# EAGLE design WMC (EAGLE 9.5.1)

## Sheet 1 of 2
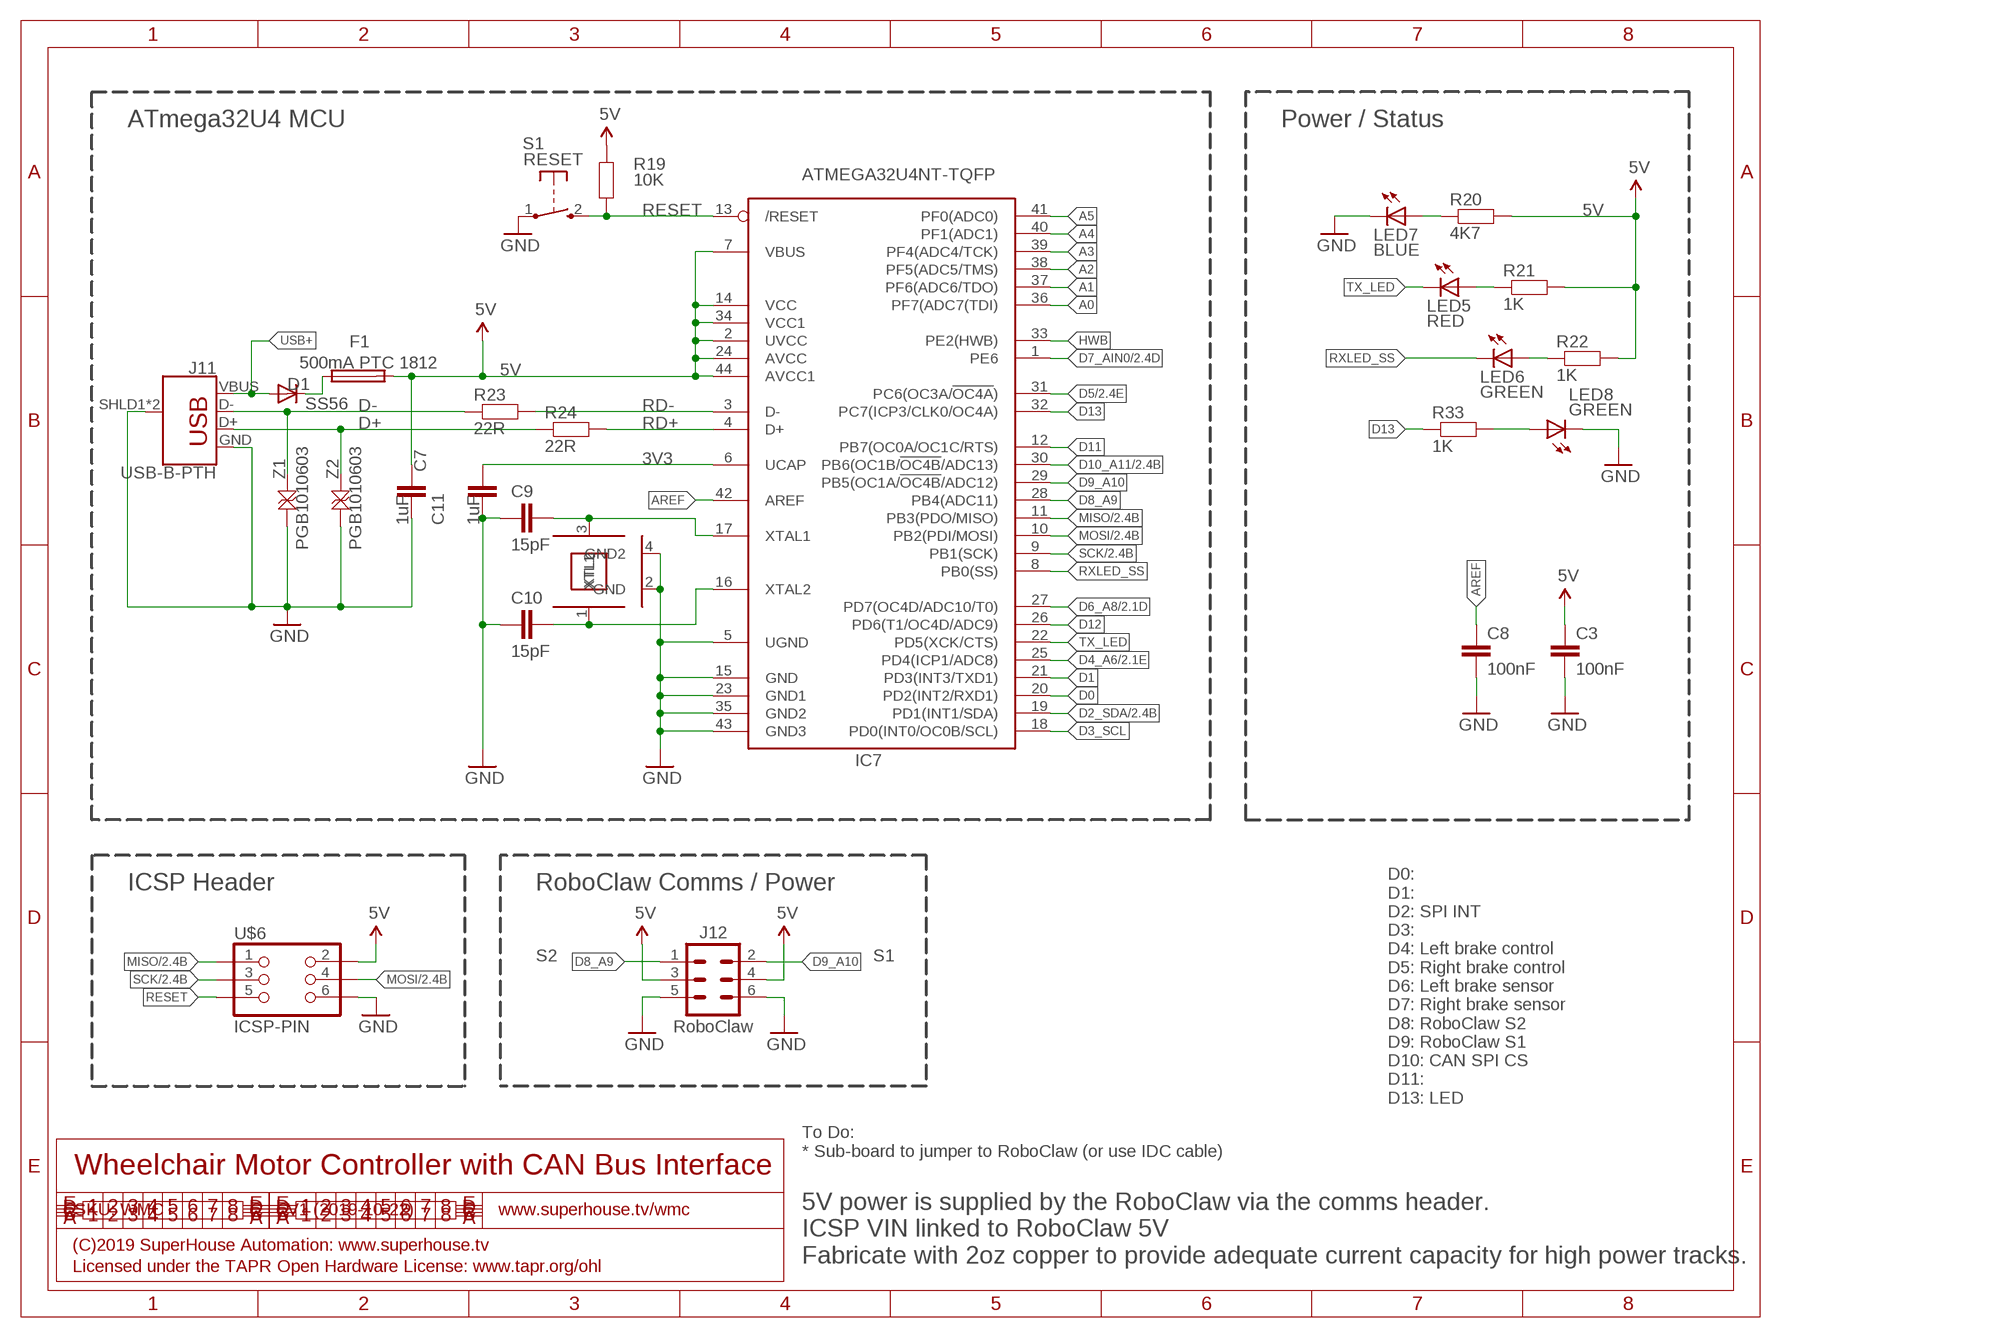
[diagram p0: schematic, sheet 1]

### Parts
C3  100nF  CAP0603  [C0603]
C7  1uF  CAP0603  [C0603]
C8  100nF  CAP0603  [C0603]
C9  15pF  CAP0603  [C0603]
C10  15pF  CAP0603  [C0603]
C11  1uF  CAP0603  [C0603]
D1  SS56  DIODESMA  [SMA-DIODE]
F1  500mA PTC 1812  PTC050  [1812]
IC7  ATMEGA32U4NT-TQFP  [TQFP44]
J11  USB-B-PTH  [USB-B-PTH]
J12  RoboClaw  M02X3-PIN  [2X03-P]
LED5  RED  LED0603  [LED-0603]
LED6  GREEN  LED0603  [LED-0603]
LED7  BLUE  LED0603  [LED-0603]
LED8  GREEN  LED0603  [LED-0603]
R19  10K  RESISTOR0603  [R0603]
R20  4K7  RESISTOR0603  [R0603]
R21  1K  RESISTOR0603  [R0603]
R22  1K  RESISTOR0603  [R0603]
R23  22R  RESISTOR0603  [R0603]
R24  22R  RESISTOR0603  [R0603]
R33  1K  RESISTOR0603  [R0603]
S1  RESET  TAC_SWITCH_2PINSMT  [TACTILE_SMT_3X4X2]
U$6  ICSP-PIN  [2X03-ICSP]
XTL2  16MHz  CRYSTAL-GND3X2  [CRYSTAL-SMD-3X2]
Z1  PGB1010603  TVS0603  [TVS0603]
Z2  PGB1010603  TVS0603  [TVS0603]

### Nets
3V3: C11.2 IC7.6(UCAP)
5V: C3.1 C7.1 F1.2 IC7.2(UVCC) IC7.7(VBUS) IC7.14(VCC) IC7.24(AVCC) IC7.34(VCC1) IC7.44(AVCC1) J12.3 J12.4 R19.2 R20.2 R21.2 R22.2 U$6.2 ; also sheet 2
A0: IC7.36(PF7(ADC7(TDI))
A1: IC7.37(PF6(ADC6/TDO))
A2: IC7.38(PF5(ADC5/TMS))
A3: IC7.39(PF4(ADC4/TCK))
A4: IC7.40(PF1(ADC1))
A5: IC7.41(PF0(ADC0))
AREF: C8.1 IC7.42(AREF)
D0: IC7.20(PD2(INT2/RXD1))
D1: IC7.21(PD3(INT3/TXD1))
D2_SDA: IC7.19(PD1(INT1/SDA)) ; also sheet 2
D3_SCL: IC7.18(PD0(INT0/OC0B/SCL))
D4_A6: IC7.25(PD4(ICP1/ADC8)) ; also sheet 2
D5: IC7.31(PC6(OC3A/!OC4A!)) ; also sheet 2
D6_A8: IC7.27(PD7(OC4D/ADC10/T0)) ; also sheet 2
D7_AIN0: IC7.1(PE6) ; also sheet 2
D8_A9: IC7.28(PB4(ADC11)) J12.1
D9_A10: IC7.29(PB5(OC1A/!OC4B!/ADC12)) J12.2
D10_A11: IC7.30(PB6(OC1B/!OC4B!/ADC13)) ; also sheet 2
D11: IC7.12(PB7(OC0A/OC1C/RTS))
D12: IC7.26(PD6(T1/OC4D/ADC9))
D13: IC7.32(PC7(ICP3/CLK0/OC4A)) R33.1
D+: J11.D+ R24.1 Z2.2
D-: J11.D- R23.1 Z1.2
GND: C3.2 C7.2 C8.2 C9.1 C10.1 C11.1 IC7.5(UGND) IC7.15(GND) IC7.23(GND1) IC7.35(GND2) IC7.43(GND3) J11.GND J11.SHLD1(SHIELD) J11.SHLD2(SHIELD) J12.5 J12.6 LED7.C LED8.C S1.1(P) U$6.6 XTL2.2(GND) XTL2.4(GND2) Z1.1 Z2.1 ; also sheet 2
HWB: IC7.33(PE2(HWB))
MISO: IC7.11(PB3(PDO/MISO)) U$6.1 ; also sheet 2
MOSI: IC7.10(PB2(PDI/MOSI)) U$6.4 ; also sheet 2
N$28: C9.2 IC7.17(XTAL1) XTL2.3(XTL2)
N$29: C10.2 IC7.16(XTAL2) XTL2.1(XTL1)
N$30: LED7.A R20.1
N$31: LED5.A R21.1
N$32: LED6.A R22.1
N$40: D1.C F1.1
N$43: LED8.A R33.2
RD+: IC7.4(D+) R24.2
RD-: IC7.3(D-) R23.2
RESET: IC7.13(/RESET) R19.1 S1.2(S) U$6.5
RXLED_SS: IC7.8(PB0(SS)) LED6.C
SCK: IC7.9(PB1(SCK)) U$6.3 ; also sheet 2
TX_LED: IC7.22(PD5(XCK/CTS)) LED5.C
USB+: D1.A J11.VBUS

### Notes on the sheet
- ATmega32U4 MCU | Power / Status
- ICSP Header | RoboClaw Comms / Power
- S2 | S1
- D0:
  D1:
  D2: SPI INT
  D3: 
  D4: Left brake control
  D5: Right brake control
  D6: Left brake sensor
  D7: Right brake sensor
  D8: RoboClaw S2
  D9: RoboClaw S1
  D10: CAN SPI CS
  D11: 
  D13: LED
- To Do:
  * Sub-board to jumper to RoboClaw (or use IDC cable)
- Wheelchair Motor Controller with CAN Bus Interface
- SKU: WMC | V1 (2019-10-22) | www.superhouse.tv/wmc
- (C)2019 SuperHouse Automation: www.superhouse.tv
- 5V power is supplied by the RoboClaw via the comms header.
  ICSP VIN linked to RoboClaw 5V
  Fabricate with 2oz copper to provide adequate current capacity for high power tracks.
- Licensed under the TAPR Open Hardware License: www.tapr.org/ohl

## Sheet 2 of 2
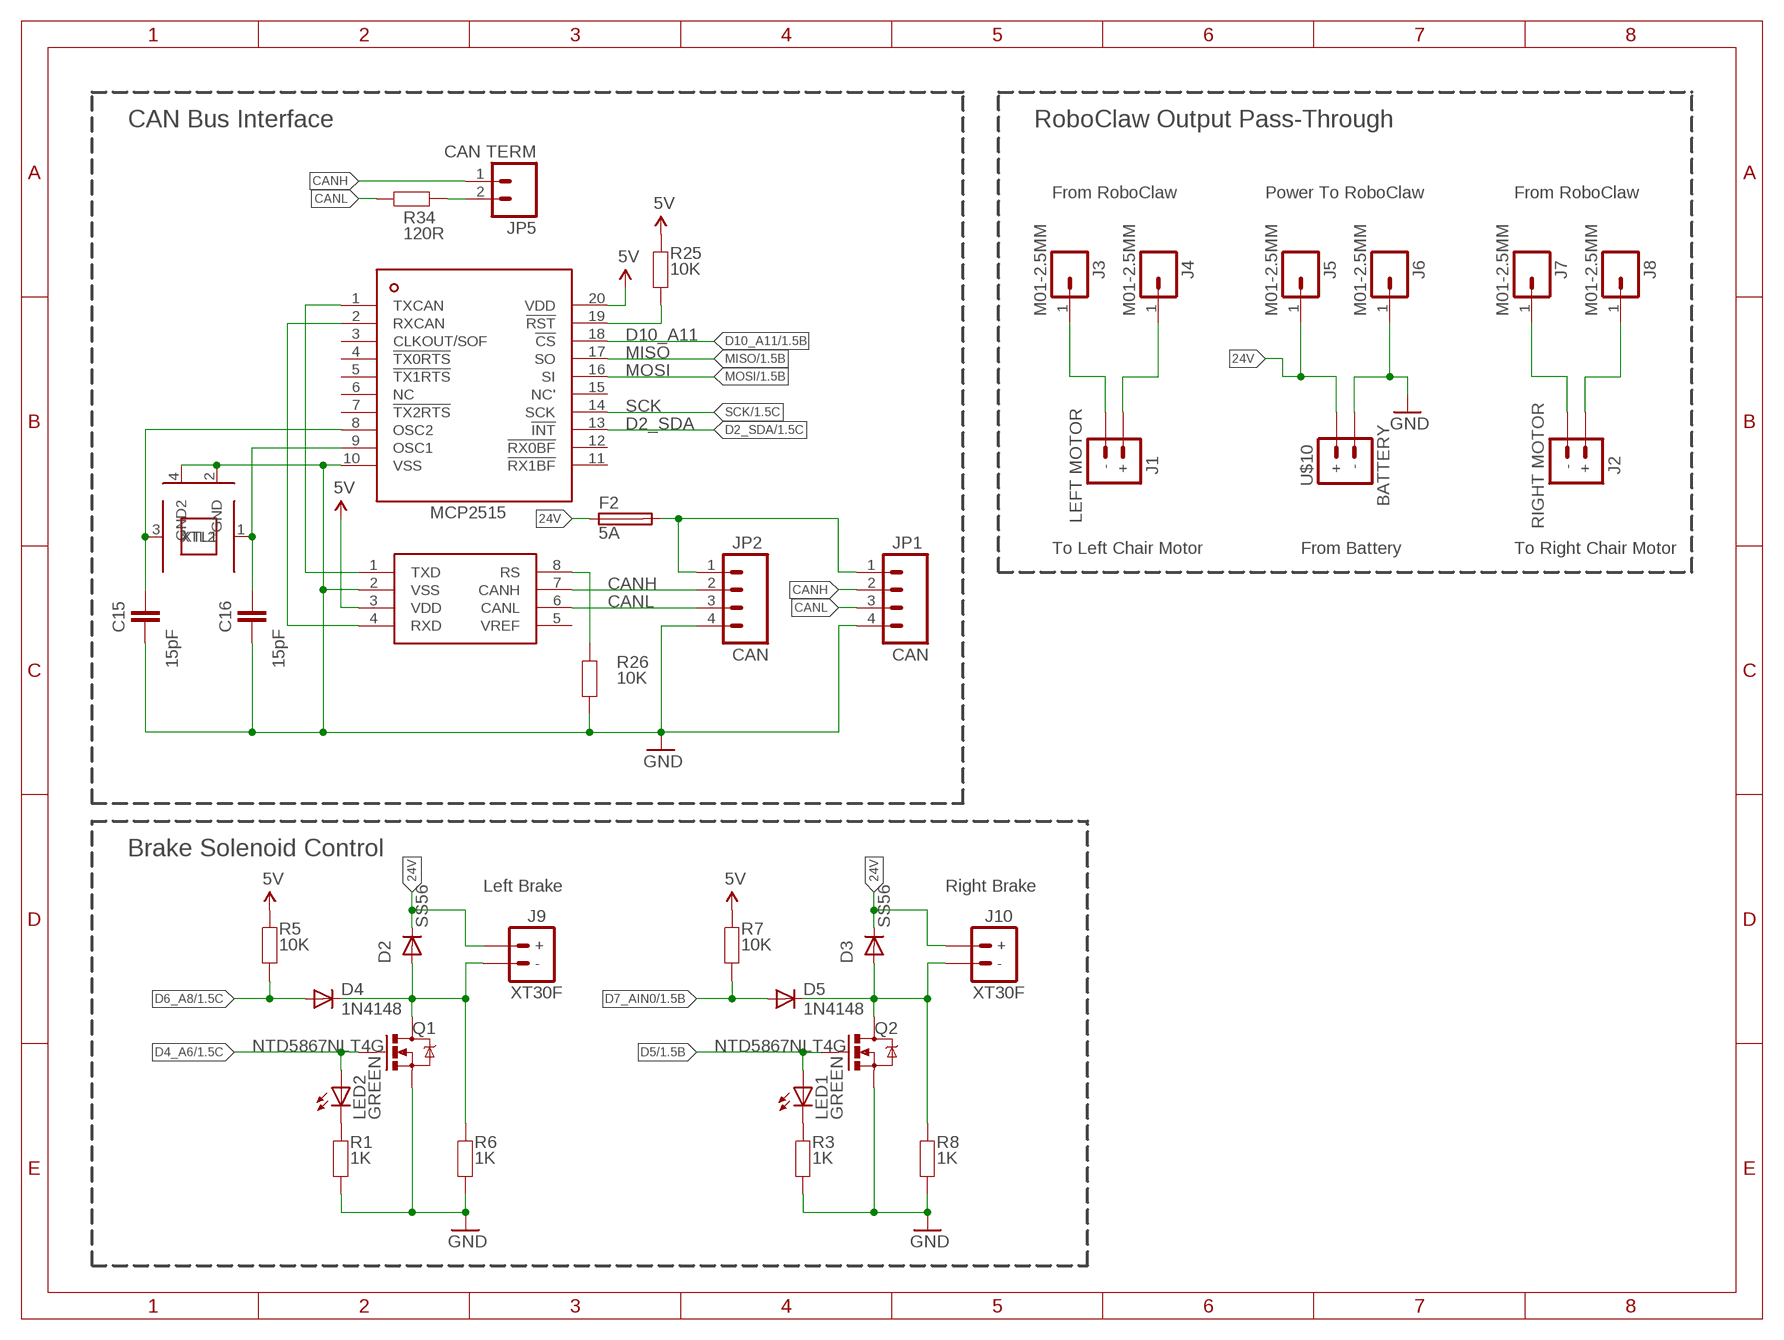
[diagram p1: schematic, sheet 2]

### Parts
C15  15pF  CAP0603  [C0603]
C16  15pF  CAP0603  [C0603]
D2  SS56  DIODESMA  [SMA-DIODE]
D3  SS56  DIODESMA  [SMA-DIODE]
D4  1N4148  DIODESOD  [SOD-323]
D5  1N4148  DIODESOD  [SOD-323]
F2  5A  FUSE  [MCCQ-122]
IC5  MCP2551  [SO08]
IC6  MCP2515  [TSSOP20]
J1  LEFT MOTOR  XTXX-60F  [XT60PW-F]
J2  RIGHT MOTOR  XTXX-60F  [XT60PW-F]
J3  M01-2.5MM  [1X01-2.5MM]
J4  M01-2.5MM  [1X01-2.5MM]
J5  M01-2.5MM  [1X01-2.5MM]
J6  M01-2.5MM  [1X01-2.5MM]
J7  M01-2.5MM  [1X01-2.5MM]
J8  M01-2.5MM  [1X01-2.5MM]
J9  XT30F  XTXX-30F  [XT30PW-F]
J10  XT30F  XTXX-30F  [XT30PW-F]
JP1  CAN  M04-PIN  [1X04-P]
JP2  CAN  M04-PIN  [1X04-P]
JP5  CAN TERM  M02-PIN  [1X02-P]
LED1  GREEN  LED0603  [LED-0603]
LED2  GREEN  LED0603  [LED-0603]
Q1  NTD5867NLT4G  MOSFET-NCHANNEL-DPAK  [DPACK]
Q2  NTD5867NLT4G  MOSFET-NCHANNEL-DPAK  [DPACK]
R1  1K  RESISTOR0603  [R0603]
R3  1K  RESISTOR0603  [R0603]
R5  10K  RESISTOR0603  [R0603]
R6  1K  RESISTOR0603  [R0603]
R7  10K  RESISTOR0603  [R0603]
R8  1K  RESISTOR0603  [R0603]
R25  10K  RESISTOR0603  [R0603]
R26  10K  RESISTOR0603  [R0603]
R34  120R  RESISTOR0603  [R0603]
U$10  BATTERY  XTXX-90M  [XT90PW-M]
XTL4  16MHz  CRYSTAL-GND3X2  [CRYSTAL-SMD-3X2]

### Nets
5V: IC5.3(VDD) IC6.20(VDD) R5.2 R7.2 R25.2 ; also sheet 1
24V: D2.C D3.C F2.1 F2.2 J5.1 J9.+ J10.+ U$10.+
CANH: IC5.7(CANH) JP1.2 JP2.2 JP5.1
CANL: IC5.6(CANL) JP1.3 JP2.3 R34.1
D2_SDA: IC6.13(!INT) ; also sheet 1
D4_A6: LED2.A Q1.1(G) ; also sheet 1
D5: LED1.A Q2.1(G) ; also sheet 1
D6_A8: D4.2(A) R5.1 ; also sheet 1
D7_AIN0: D5.2(A) R7.1 ; also sheet 1
D10_A11: IC6.18(!CS) ; also sheet 1
GND: C15.1 C16.1 IC5.2(VSS) IC6.10(VSS) J6.1 JP1.4 JP2.4 Q1.3(S) Q2.3(S) R1.1 R3.1 R6.1 R8.1 R26.1 U$10.- XTL4.2(GND) XTL4.4(GND2) ; also sheet 1
LEFT_BRAKE: D2.A D4.1(C) J9.- Q1.2(D) R6.2
MISO: IC6.17(SO) ; also sheet 1
MOSI: IC6.16(SI) ; also sheet 1
N$1: LED2.C R1.2
N$2: F2.3 F2.4 JP1.1 JP2.1
N$3: J1.+ J4.1
N$5: LED1.C R3.2
N$9: J1.- J3.1
N$14: J2.- J7.1
N$15: J2.+ J8.1
N$33: IC6.19(!RST) R25.1
N$34: IC5.1(TXD) IC6.1(TXCAN)
N$35: IC5.4(RXD) IC6.2(RXCAN)
N$36: IC5.8(RS) R26.2
N$37: C15.2 IC6.8(OSC2) XTL4.3(XTL2)
N$38: C16.2 IC6.9(OSC1) XTL4.1(XTL1)
N$44: JP5.2 R34.2
RIGHT_BRAKE: D3.A D5.1(C) J10.- Q2.2(D) R8.2
SCK: IC6.14(SCK) ; also sheet 1
Unconnected: IC5.5(VREF) IC6.3(CLKOUT/SOF) IC6.4(!TX0RTS) IC6.5(!TX1RTS) IC6.6(NC) IC6.7(!TX2RTS) IC6.11(!RX1BF) IC6.12(!RX0BF) IC6.15(NC')

### Notes on the sheet
- CAN Bus Interface | RoboClaw Output Pass-Through
- From RoboClaw | Power To RoboClaw | From RoboClaw
- To Left Chair Motor | From Battery | To Right Chair Motor
- Brake Solenoid Control
- Left Brake | Right Brake

## Library data of the parts
C3 C7-C11 C15 C16 = SuperHouse-DiscreteSemi:CAP: Capacitor Standard ceramic capacitor
D1-D5 = SuperHouse-DiscreteSemi:DIODE: Diode Standard reverse protection diodes and small signal diodes. SMA package can handle up to about 1A. SOD-323 can handle about 200mA.
F1 = SuperHouse-Fuses:PTC: MF-SMDF Series - PRC Resettable Fuses Source: http://www.farnell.com/datasheets/716597.pdf
F2 = SuperHouse-Fuses:FUSE
IC5 = SuperHouse-ICs:MCP2551: CAN bus transceiver. Pin compatible chips with different specs include: MCP2551 (5V only) TCAN332DR (3.3V)
IC6 = SuperHouse-ICs:MCP2515: Microchip Technology’s MCP2515 is a stand-alone Controller Area Network (CAN) controller that implements the CAN specification, version 2.0B. It is capable of transmitting and receiving both standard and extended data and remote frames. The MCP2515 has two acceptance masks and six acceptance filters that are used to filter out unwanted messages, thereby reducing the host MCUs overhead. The MCP2515 interfaces with microcontrollers (MCUs) via an industry standard Serial Peripheral Interface (SPI).
IC7 = SuperHouse-MCUs:ATMEGA32U4NT: ATmega32u4 MCU
J1 J2 J9 J10 U$10 = SuperHouse-Connectors:XTXX: XT30/60/90 connector
J3-J8 = SuperHouse-Connectors:M01: 1-way header Standard 1x1 header
J11 = SuperHouse-Connectors:USB-B: USB Type B Connector
J12 = SuperHouse-Connectors:M02X3: 0.1" header, 2x3 (6-way)
JP1 JP2 = SuperHouse-Connectors:M04: 4-way header Standard 1x4 header, and screw terminal variations
JP5 = SuperHouse-Connectors:M02: 2-way header Standard 1x2 header, and screw terminal variations
LED1 LED2 LED5-LED8 = SuperHouse-LEDs:LED: LEDs Standard schematic elements and footprints for 5mm, 3mm, 1206, and 0603 sized LEDs. 5mm - Spark Fun Electronics SKU : COM-00529 (and others)
Q1 Q2 = SuperHouse-DiscreteSemi:MOSFET-NCHANNEL: N-channel MOSFET
R1 R3 R5-R8 R19-R26 R33 R34 = SuperHouse-DiscreteSemi:RESISTOR: Resistor Standard resistors.
S1 = SuperHouse-Switches:TAC_SWITCH_2PIN: Momentary Tactile Switch - 2 pin Uxcell 3x4x2mm switch with 2 SMT pads
U$6 = SuperHouse-Connectors:ICSP
XTL2 XTL4 = SuperHouse-Oscillators:CRYSTAL-GND: 3x2mm SMT crystal
Z1 Z2 = SuperHouse-DiscreteSemi:TVS: TVS voltage protection Zener

## Board
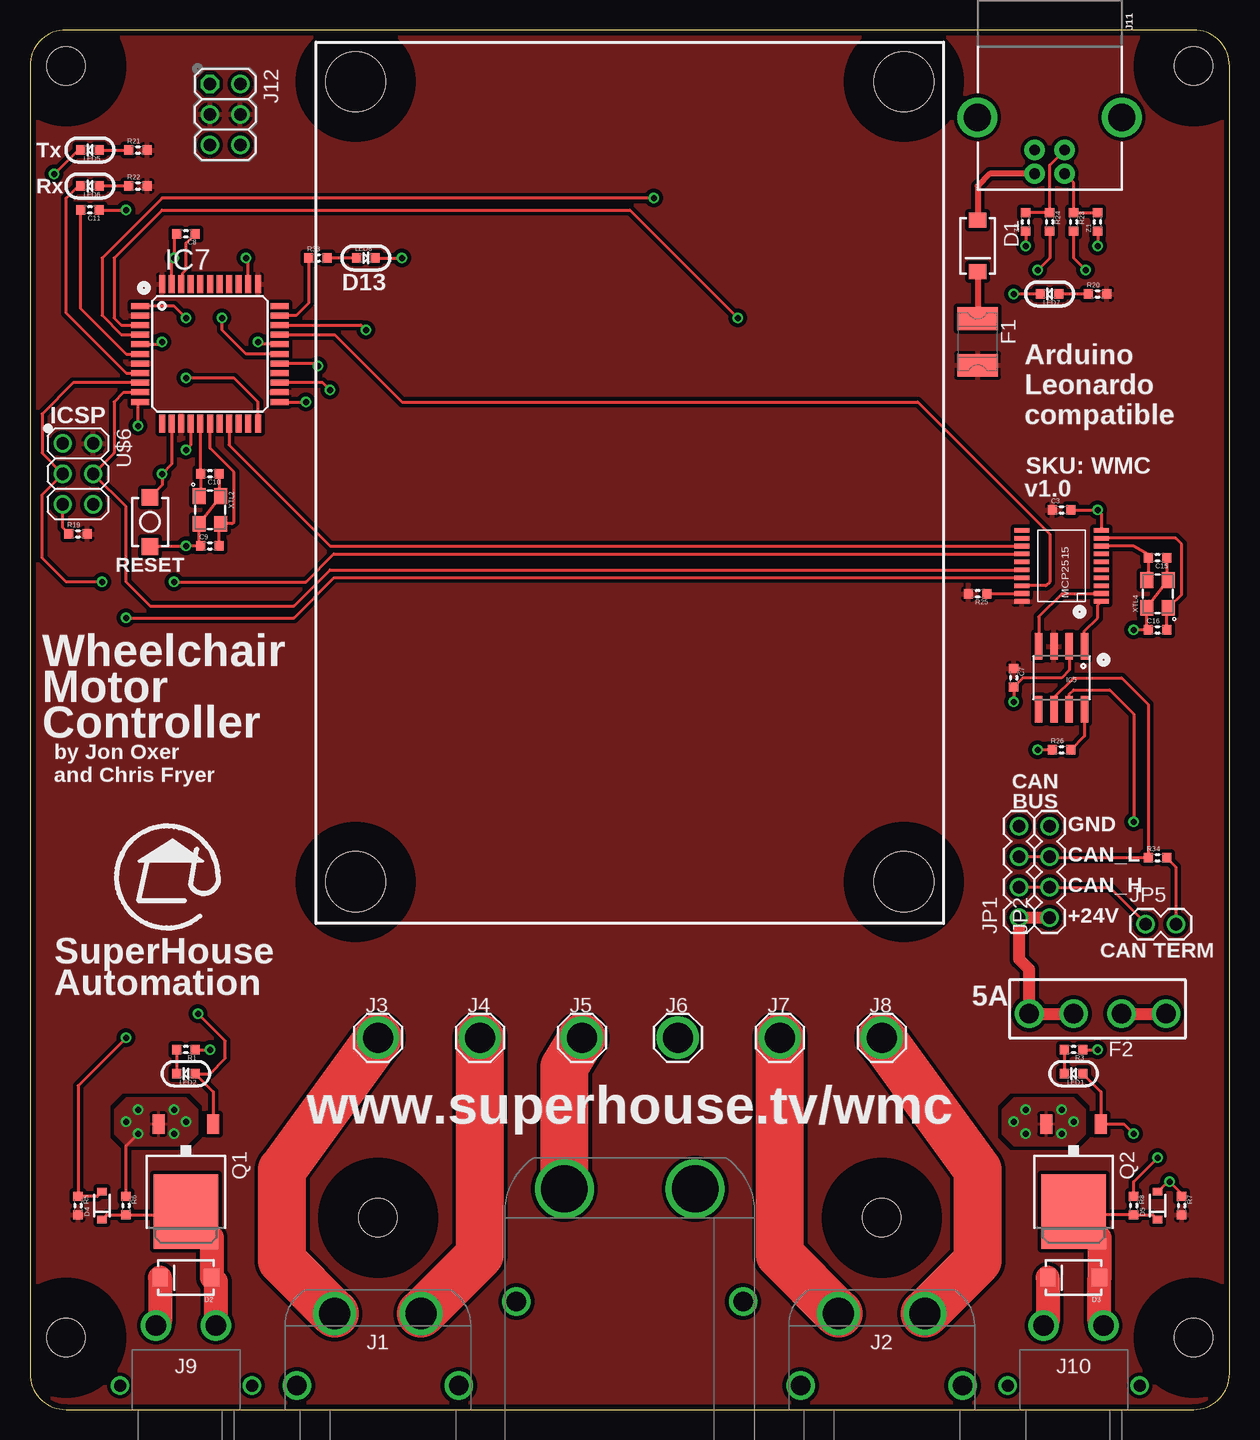
[diagram p2: board, top side]
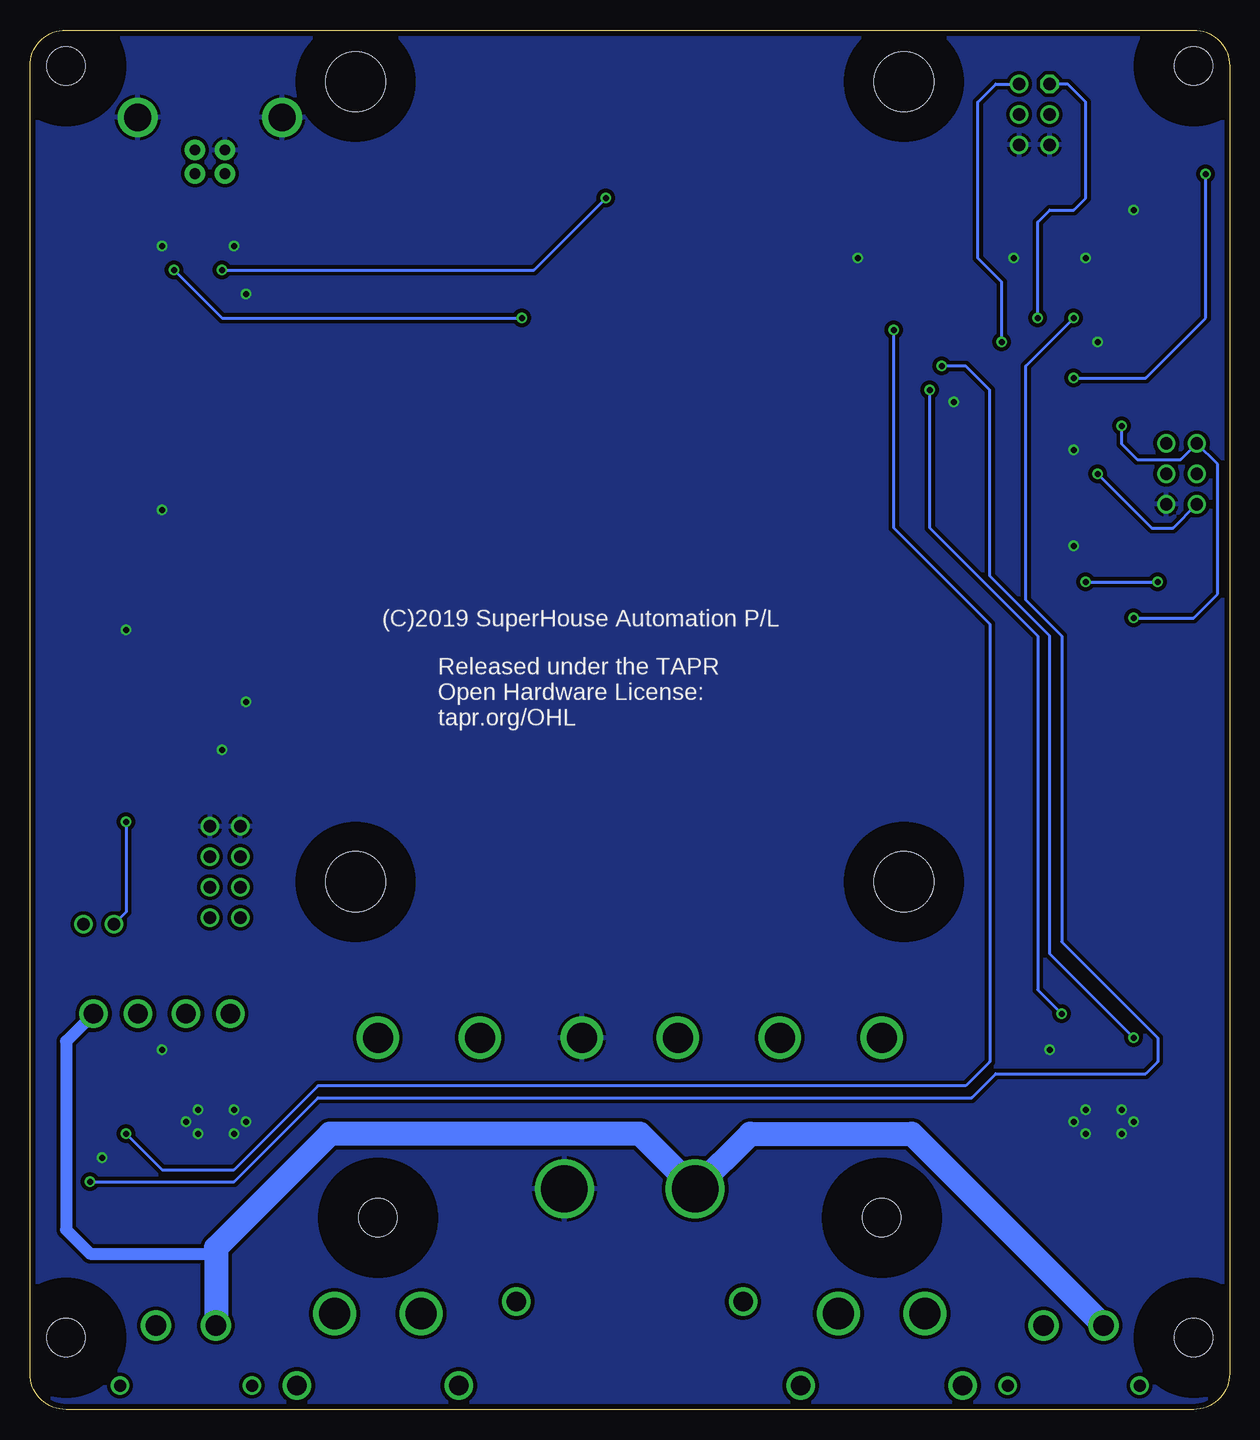
[diagram p3: board, bottom side, seen from below]

Size 100 x 115 mm. Coordinates in mm from the lower left corner, seen from the top.
Outline: 97,115 3,115 arc90 0,112 0,3 arc90 3,0 97,0 arc90 100,3 100,112 arc90 97,115
Copper layers (1*16): Top 0.035mm / dielectric 1.5mm / Bottom 0.035mm
Design rules "default *": minimum track width 10mil, minimum drill 0.5mm, track to track 12mil, track to pad 12mil, pad to pad 12mil, via to via 12mil, smd to smd 8mil, copper to edge 18mil, drill to drill 8mil, minimum pad ring 10mil, minimum via ring 8mil, stop-mask expansion 0.4mm, vias tented up to drill 0.7mm, thermal gap 10mil
Holes 3.2 mm at 97,6 3,6 3,112 29,16 71,16 97,112
Holes 5 mm at 72.86,44 27.14,44 72.86,110.68 27.14,110.68
tRestrict: area 26,13 to 32,19; area 68,13 to 74,19; area 94,3 to 100,9; area 0,3 to 6,9; area 0,109 to 6,115; area 94,109 to 100,115; area 69.9,107.7 to 75.9,113.7; area 69.9,41 to 75.9,47; area 24.1,41 to 30.1,47; area 24.1,107.7 to 30.1,113.7
bRestrict: area 94,3 to 100,9; area 68,13 to 74,19; area 26,13 to 32,19; area 0,3 to 6,9; area 0,109 to 6,115; area 94,109 to 100,115; area 24.1,107.7 to 30.1,113.7; area 69.9,107.7 to 75.9,113.7; area 24.1,41 to 30.1,47; area 69.9,41 to 75.9,47

### Footprints (pad centres in the part's own frame; a part is rotated, then mirrored left to right if it is on the bottom)
C0603 = smd 0.762 x 0.762: 1 -0.762,0; 2 0.762,0
SMA-DIODE = smd 1.27 x 1.47: A -2.15,0; C 2.15,0
SOD-323 = smd 0.63 x 0.83: 1 -1.15,0; 2 1.15,0
1812 = smd 1.9 x 3.4: 1 -1.95,0; 2 1.95,0
MCCQ-122 = drill 1.6: 1 -5.7,0; 2 -2,0; 3 2,0; 4 5.7,0
SO08 = smd 0.61 x 2.21: 1 -1.905,-2.616; 2 -0.635,-2.616; 3 0.635,-2.616; 4 1.905,-2.616; 5 1.905,2.616; 6 0.635,2.616; 7 -0.635,2.616; 8 -1.905,2.616
TSSOP20 = smd 1.27 x 0.381: 1 -3.302,2.642; 2 -3.302,1.981; 3 -3.302,1.321; 4 -3.302,0.66; 5 -3.302,0; 6 -3.302,-0.66; 7 -3.302,-1.321; 8 -3.302,-1.981; 9 -3.302,-2.642; 10 -3.302,-3.302; 11 3.302,-3.302; 12 3.302,-2.642; 13 3.302,-1.981; 14 3.302,-1.321; 15 3.302,-0.66; 16 3.302,0; 17 3.302,0.66; 18 3.302,1.321; 19 3.302,1.981; 20 3.302,2.642
TQFP44 = smd 1.5 x 0.5: 1 -5.8,4; 2 -5.8,3.2; 3 -5.8,2.4; 4 -5.8,1.6; 5 -5.8,0.8; 6 -5.8,0; 7 -5.8,-0.8; 8 -5.8,-1.6; 9 -5.8,-2.4; 10 -5.8,-3.2; 11 -5.8,-4; 23 5.8,-4; 24 5.8,-3.2; 25 5.8,-2.4; 26 5.8,-1.6; 27 5.8,-0.8; 28 5.8,0; 29 5.8,0.8; 30 5.8,1.6; 31 5.8,2.4; 32 5.8,3.2; 33 5.8,4 | smd 0.5 x 1.5: 12 -4,-5.8; 13 -3.2,-5.8; 14 -2.4,-5.8; 15 -1.6,-5.8; 16 -0.8,-5.8; 17 0,-5.8; 18 0.8,-5.8; 19 1.6,-5.8; 20 2.4,-5.8; 21 3.2,-5.8; 22 4,-5.8; 34 4,5.8; 35 3.2,5.8; 36 2.4,5.8; 37 1.6,5.8; 38 0.8,5.8; 39 0,5.8; 40 -0.8,5.8; 41 -1.6,5.8; 42 -2.4,5.8; 43 -3.2,5.8; 44 -4,5.8
XT60PW-F = drill 2.6: + 3.6,6; - -3.6,6 | drill 1.6: P$1 -6.75,0; P$2 6.75,0
1X01-2.5MM = drill 2.5: 1 0,0
XT30PW-F = drill 1.7: + -2.5,5; - 2.5,5 | drill 1: P$1 -5.5,0; P$2 5.5,0
USB-B-PTH = drill 0.914 pad 1.676: D+ 4,1.25; D- 5.981,1.25; GND 4,-1.25; VBUS 5.981,-1.25 | drill 2.286: SHLD1 1.282,-6.02; SHLD2 1.282,6.02
2X03-P = drill 1.016 octagon: 1 0,0 | drill 1.016: 2 0,2.54; 3 2.54,0; 4 2.54,2.54; 5 5.08,0; 6 5.08,2.54
1X04-P = drill 1.016: 1 0,0; 2 2.54,0; 3 5.08,0; 4 7.62,0
1X02-P = drill 1.016: 1 0,0; 2 2.54,0
LED-0603 = smd 0.762 x 0.762: A -0.762,0; C 0.762,0
DPACK = smd 1 x 1.6: 1 -2.28,-4.8; 3 2.28,-4.8 | smd 5.4 x 6.2: 2 0,2.5
R0603 = smd 0.762 x 0.762: 1 -0.762,0; 2 0.762,0
TACTILE_SMT_3X4X2 = smd 1.4 x 1.4: 1 -2.05,0; 2 2.05,0
2X03-ICSP = drill 1.016: 1 -2.54,-1.27; 2 -2.54,1.27; 3 0,-1.27; 4 0,1.27; 5 2.54,-1.27; 6 2.54,1.27
XT90PW-M = drill 3.9: + -5.45,9.4; - 5.45,9.4 | drill 1.6: P$1 -9.45,0; P$2 9.45,0
CRYSTAL-SMD-3X2 = smd 1.3 x 1.1: 1 -1.15,-0.9; 2 1.15,-0.9; 3 1.15,0.9; 4 -1.15,0.9
TVS0603 = smd 0.762 x 0.762: 1 -0.762,0; 2 0.762,0

### Placement (x,y rotation side)
C3  86,75 0 top
C7  82,61 270 top
C8  13,98 180 top
C9  15,72 0 top
C10  15,78 180 top
C11  5,100 180 top
C15  94,71 180 top
C16  94,65 0 top
D1  79,97 270 top
D2  13,11 180 top
D3  87,11 180 top
D4  6,17 90 top
D5  94,17 90 top
F1  79,89 270 top
F2  89,33 180 top
IC5  86,61 180 top
IC6  86,70 180 top
IC7  15,88 0 top
J1  29,2 0 top
J2  71,2 0 top
J3  29,31 0 top
J4  37.5,31 0 top
J5  46,31 0 top
J6  54,31 0 top
J7  62.5,31 0 top
J8  71,31 0 top
J9  13,2 0 top
J10  87,2 0 top
J11  85,109 270 top
J12  15,110.5 270 top
JP1  82.46,41 90 top
JP2  85,41 90 top
JP5  93,40.46 0 top
LED1  RED  [LED-0603]  87,28 180 top
LED2  RED  [LED-0603]  13,28 180 top
LED5  5,105 180 top
LED6  5,102 180 top
LED7  85,93 180 top
LED8  28,96 0 top
Q1  13,19 180 top
Q2  87,19 180 top
R1  13,30 180 top
R3  87,30 180 top
R5  4,17 270 top
R6  8,17 270 top
R7  96,17 270 top
R8  92,17 270 top
R19  4,73 0 top
R20  89,93 0 top
R21  9,105 0 top
R22  9,102 0 top
R23  87,99 270 top
R24  85,99 270 top
R25  79,68 180 top
R26  86,55 0 top
R33  24,96 0 top
R34  94,46 0 top
S1  10,74 90 top
U$6  4,78 270 top
U$10  50,9 0 top
XTL2  15,75 270 top
XTL4  94,68 90 top
Z1  89,99 90 top
Z2  83,99 90 top

### Tracks (layer width: path | path; a pad name or v marks a point on that pad's centre or on a via)
3V3
  Top 0.254: IC7.6 8,88 4.24,91.76 C11.2
5V
  pour Top (rank 3): 97,115 arc-90 100,112 100,0 0,0 0,115
24V
  Top 1.016: F2.2 F2.1
  Top 2: D3.C 84.85,7.35 J10.+ | D2.C 10.85,7.35 J9.+
  Top 4: U$10.+ 44.55,28.55 J5.1
  Bottom 1.016: F2.1 97,30.7 97,15 95,13 85,13 84.5,13.5
  Bottom 2: J10.+ 84.5,13.5 75,23 49.15,23 U$10.+ 39.95,23 26.5,23 J9.+
AREF
  Top 0.254: IC7.42 12.72,93.92 12.72,94.73 13,95.01 13,97.24 C8.1
CANH  (via drill 0.5)
  Top 0.254: JP5.1 93,40.54 90,43.54 JP2.2 JP1.2 | IC5.7 86.64,59.63 87,60 90,60 92,58 v92,49
  Bottom 0.254: v92,49 92,41.46 JP5.1
CANL
  Top 0.254: IC5.6 85.36,59.37 87,61 91,61 93.24,58.76 R34.1 85.08,46 JP2.3 JP1.3
D2_SDA
  Top 0.254: IC7.19 16.6,80.4 25.02,71.98 IC6.13
D4_A6  (via drill 0.5)
  Top 0.254: v25,85 24.4,85.6 IC7.25 | v14,33 16.28,30.72 16.28,29.28 15,28 LED2.A 15.28,26.48 Q1.1
  Bottom 0.254: v25,85 25,73.5 16,64.5 16,35 v14,33
D5  (via drill 0.5)
  Top 0.254: IC7.31 27.6,90.4 v28,90 | LED1.A 89.28,26.48 Q2.1 91.2,23.8 v92,23
  Bottom 0.254: v92,23 89,20 83,20 76,27 22,27 20,29 20,65.5 28,73.5 v28,90
D6_A8  (via drill 0.5)
  Top 0.254: v8,31 4,27 R5.1 5.61,17.76 D4.2 | v24,87 23.8,87.2 IC7.27
  Bottom 0.254: v8,31 15,38 15,64.5 20,69.5 20,85 22,87 v24,87
D7_AIN0  (via drill 0.5)
  Top 0.254: v13,91 12,92 IC7.1 | D5.2 94.85,19 v95,19 96,18 R7.1
  Bottom 0.254: v95,19 83,19 76,26 21.5,26 19.5,28 7,28 6,29 6,31 14,39 14,64.5 17,67.5 17,87 v13,91
D8_A9  (via drill 0.5)
  Top 0.254: IC7.28 18,88 16,90 v16,91
  Bottom 0.254: v16,91 16,99 15,100 13,100 12,101 12,109 13.5,110.5 J12.1
D9_A10  (via drill 0.5)
  Top 0.254: IC7.29 19.2,88.8 v19,89
  Bottom 0.254: v19,89 19,94 21,96 21,109 19.5,110.5 J12.2
D10_A11
  Top 0.254: IC6.18 84.68,68.68 85,69 85,73 74,84 31,84 25.4,89.6 IC7.30
D13
  Top 0.254: R33.1 23.24,92.24 22.2,91.2 IC7.32
D+
  Top 0.254: Z2.2 R24.1 85,103.75 J11.D+
D-
  Top 0.254: Z1.2 R23.1 87,102.27 J11.D-
GND  (via drill 0.5)
  Top 0.254: C15.1 94.76,69.29 XTL4.2 XTL4.4 93.1,65.14 C16.1 v92,65 | C3.2 v89,75 89.3,74.7 IC6.10 | IC5.2 86.64,61.63 86,61 82.76,61 C7.2 v82,59 | C10.1 15.76,76.29 XTL2.4 XTL2.2 14.1,72.14 C9.1 v13,72 10.05,72 S1.1 | IC7.15 13.4,80.4 v13,80 | IC7.23 v23,84 | IC7.43 11.8,95.8 v12,96 12,97.76 C8.2 | IC7.35 18.2,95.8 v18,96 | R8.1 92,19 v94,21 | R6.1 8,22 v9,23 | C11.1 v8,100 | LED8.C v31,96 | Z2.1 v83,97 | Z1.1 v89,97 | IC7.5 10.8,88.8 v11,89 | LED7.C v82,93 | R26.1 v84,55 | R1.1 v15,30 | R3.1 v89,30
  other vias: 83,25 82,24 83,23 86,25 87,24 86,23 9,25 8,24 12,23 13,24 12,25
  pour Bottom: 97,115 arc-90 100,112 100,0 0,0 0,115
  pour Top (rank 2): 82,26 81,25 81,23 82,22 87,22 88,23 88,25 87,26
  pour Top: 7,25 7,23 8,22 13,22 14,23 14,25 13,26 8,26
LEFT_BRAKE
  Top 0.254: Q1.2 13,17 12.24,16.24 R6.2 6.39,16.24 D4.1
  Top 2: J9.- 15.5,10.65 D2.A 15.15,14.35 Q1.2
MISO  (via drill 0.5)
  Top 0.254: v9,82 9,83.8 IC7.11 | v8,66 22,66 25.34,69.34 IC6.17
  Bottom 0.254: v9,82 9,80.5 7.69,79.19 4.08,79.19 U$6.1 1,78.81 1,68 3,66 v8,66
MOSI
  Top 0.254: IC7.10 7.8,84.8 7,84 7,79.73 U$6.4 8,75.27 8,69 10,67 22,67 25,70 IC6.16
N$1
  Top 0.254: R1.2 LED2.C
N$2
  Top 1.016: F2.3 F2.4 83.3,36.7 82.46,37.54 JP1.1 JP2.1
N$3
  Top 4: J4.1 37.5,12.9 J1.+
N$5
  Top 0.254: R3.2 LED1.C
N$9
  Top 4: J1.- 21,12.4 21,20 J3.1
N$14
  Top 4: J7.1 62.5,12.9 J2.-
N$15
  Top 4: J2.+ 79,12.4 79,20 J8.1
N$28
  Top 0.254: C9.2 15.76,73.71 XTL2.3 16.85,73.85 17,74 17,78.14 15,80.14 IC7.17
N$29
  Top 0.254: XTL2.1 14.24,76.29 C10.2 14.2,78.04 IC7.16
N$30
  Top 0.254: R20.1 LED7.A
N$31
  Top 0.254: LED5.A R21.1
N$32
  Top 0.254: R22.1 LED6.A
N$33
  Top 0.254: IC6.19 82.68,68 R25.1
N$34
  Top 0.254: IC6.1 89,67.06 89,66 87.91,64.91 IC5.1
N$35
  Top 0.254: IC6.2 89.28,68 86,68 84.09,66.09 IC5.4
N$36
  Top 0.254: IC5.8 87.91,56.14 R26.2
N$37
  Top 0.254: XTL4.3 93.24,69.29 C15.2 93.24,71.28 91.98,71.98 IC6.8
N$38
  Top 0.254: C16.2 94.76,66.71 XTL4.1 96,67.95 96,72.14 95.51,72.64 IC6.9
N$40
  Top 0.508: D1.C F1.1
N$43
  Top 0.254: LED8.A R33.2
N$44
  Top 0.254: R34.2 95.54,45.22 JP5.2
RD+  (via drill 0.5)
  Top 0.254: R24.2 85,96 v84,95 | v52,101 11,101 6,96 6,91.21 7.61,89.6 IC7.4
  Bottom 0.254: v52,101 58,95 v84,95
RD-  (via drill 0.5)
  Top 0.254: v59,91 50,100 11,100 7,96 7,91 7.6,90.4 IC7.3 | v88,95 87,96 R23.2
  Bottom 0.254: v59,91 84,91 v88,95
RESET  (via drill 0.5)
  Top 0.254: IC7.13 11.8,78.8 v11,78 11,77.05 S1.2 | R19.1 2.73,73.51 U$6.5
  Bottom 0.254: v11,78 6.5,73.5 4.69,73.5 U$6.5
RIGHT_BRAKE
  Top 0.254: Q2.2 87,17 87.76,16.24 R8.2 93.61,16.24 D5.1
  Top 2: J10.- 89.15,7.35 D3.A 89.15,14.35 Q2.2
RXLED_SS
  Top 0.254: IC7.8 8,86.4 3,91.4 3,101 4,102 LED6.C
SCK  (via drill 0.5)
  Top 0.254: IC6.14 25.32,71.32 23,69 v12,69 | IC7.9 3.6,85.6 1,83 1,79.73 U$6.3 1,76.27 1,71 3,69 v6,69
  Bottom 0.254: v12,69 v6,69
TX_LED  (via drill 0.5)
  Top 0.254: IC7.22 19,84 17,86 v13,86 | v2,103 4,105 LED5.C
  Bottom 0.254: v13,86 7,86 2,91 v2,103
USB+
  Top 0.508: D1.A 79,102 80.02,103.02 J11.VBUS

### Text on the board
tPlace: Tx | Rx | D13 | ICSP | Arduino / Leonardo / compatible | SKU: WMC | v1.0 | RESET | Wheelchair / Motor / Controller | by Jon Oxer / and Chris Fryer | CAN / BUS | GND | CAN_L | CAN_H | +24V | CAN TERM | SuperHouse / Automation | 5A | www.superhouse.tv/wmc
bPlace: (C)2019 SuperHouse Automation P/L | Released under the TAPR / Open Hardware License: / tapr.org/OHL